# EAGLE design MxxxRow (EAGLE 6.6.0)

## Sheet 1 of 6
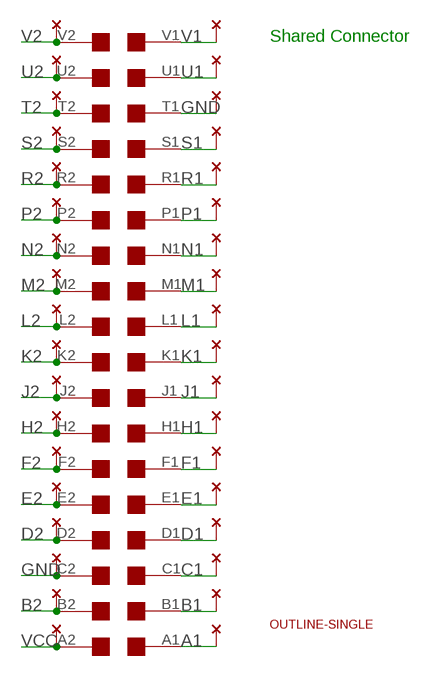
[diagram p0: schematic, sheet 1]

### Parts
U$1  EDGE-2CONNECTOR  [EDGE-CON2]
U$4  THRU-HOLE2A  [THRU-HOLEA]
U$5  OUTLINE-SINGLE  [SINGLE]

### Nets
A1: U$1.A1 U$4.A1 ; also sheet 2,3,4,5,6
B1: U$1.B1 U$4.B1 ; also sheet 2,3,4,5,6
B2: U$1.B2 U$4.B2
C1: U$1.C1 U$4.C1 ; also sheet 2,3,4,5,6
D1: U$1.D1 U$4.D1 ; also sheet 2,3,4,5,6
D2: U$1.D2 U$4.D2 ; also sheet 2,3,4,5,6
E1: U$1.E1 U$4.E1 ; also sheet 2,3,4,5
E2: U$1.E2 U$4.E2 ; also sheet 2,3,4,5,6
F1: U$1.F1 U$4.F1 ; also sheet 2,3,4,5,6
F2: U$1.F2 U$4.F2 ; also sheet 2,3,4,5,6
GND [Power]: U$1.C2 U$1.T1 U$4.C2 U$4.T1 ; also sheet 2,3,4,5,6
H1: U$1.H1 U$4.H1 ; also sheet 2,3,4,5,6
H2: U$1.H2 U$4.H2 ; also sheet 2,3,4,5,6
J1: U$1.J1 U$4.J1 ; also sheet 2,3,4,5,6
J2: U$1.J2 U$4.J2 ; also sheet 2,3,4,5,6
K1: U$1.K1 U$4.K1 ; also sheet 2,3,4,5,6
K2: U$1.K2 U$4.K2 ; also sheet 2,3,4,5,6
L1: U$1.L1 U$4.L1 ; also sheet 2,3,4,5
L2: U$1.L2 U$4.L2 ; also sheet 2,3,4,5,6
M1: U$1.M1 U$4.M1 ; also sheet 2,3,4,5,6
M2: U$1.M2 U$4.M2 ; also sheet 2,3,4,5,6
N1: U$1.N1 U$4.N1 ; also sheet 2,3,4,5,6
N2: U$1.N2 U$4.N2 ; also sheet 2,3,4,5,6
P1: U$1.P1 U$4.P1 ; also sheet 2,3,4,5,6
P2: U$1.P2 U$4.P2 ; also sheet 2,3,4,5,6
R1: U$1.R1 U$4.R1 ; also sheet 2,3,4,5,6
R2: U$1.R2 U$4.R2 ; also sheet 2,3,4,5,6
S1: U$1.S1 U$4.S1 ; also sheet 2,3,4,5
S2: U$1.S2 U$4.S2 ; also sheet 2,3,4,5,6
T2: U$1.T2 U$4.T2 ; also sheet 2,3,4,5,6
U1: U$1.U1 U$4.U1 ; also sheet 2,3,4
U2: U$1.U2 U$4.U2 ; also sheet 2,3,4,5,6
V1: U$1.V1 U$4.V1 ; also sheet 2,3,4
V2: U$1.V2 U$4.V2 ; also sheet 2,3,4,5,6
VCC [Power]: U$1.A2 U$4.A2 ; also sheet 2,3,4,5,6

### Notes on the sheet
- Shared Connector

## Sheet 2 of 6
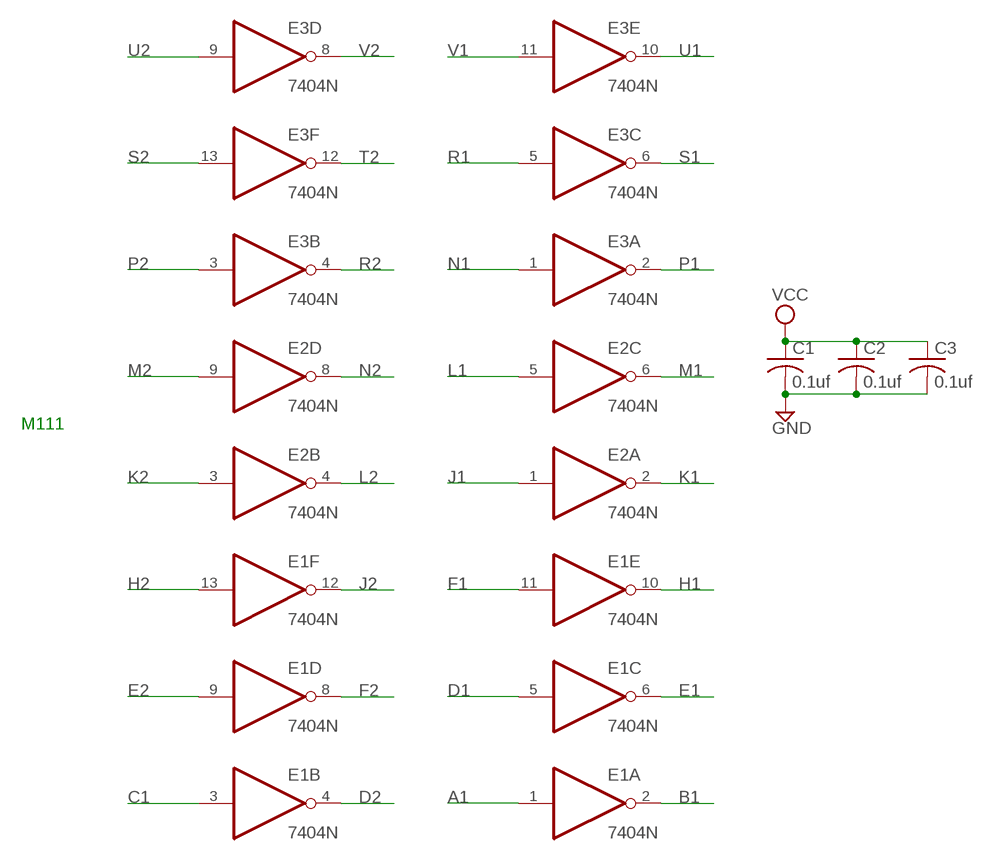
[diagram p1: schematic, sheet 2]

### Parts
C1  0.1uf  C-US050-025X075  [C050-025X075]
C2  0.1uf  C-US050-025X075  [C050-025X075]
C3  0.1uf  C-US050-025X075  [C050-025X075]
E1  7404N  [DIL14]
E2  7404N  [DIL14]
E3  7404N  [DIL14]

### Nets
A1: E1.1(A:I) ; also sheet 1,3,4,5,6
B1: E1.2(A:O) ; also sheet 1,3,4,5,6
C1: E1.3(B:I) ; also sheet 1,3,4,5,6
D1: E1.5(C:I) ; also sheet 1,3,4,5,6
D2: E1.4(B:O) ; also sheet 1,3,4,5,6
E1: E1.6(C:O) ; also sheet 1,3,4,5
E2: E1.9(D:I) ; also sheet 1,3,4,5,6
F1: E1.11(E:I) ; also sheet 1,3,4,5,6
F2: E1.8(D:O) ; also sheet 1,3,4,5,6
GND [Power]: C1.2 C2.2 C3.2 ; also sheet 1,3,4,5,6
H1: E1.10(E:O) ; also sheet 1,3,4,5,6
H2: E1.13(F:I) ; also sheet 1,3,4,5,6
J1: E2.1(A:I) ; also sheet 1,3,4,5,6
J2: E1.12(F:O) ; also sheet 1,3,4,5,6
K1: E2.2(A:O) ; also sheet 1,3,4,5,6
K2: E2.3(B:I) ; also sheet 1,3,4,5,6
L1: E2.5(C:I) ; also sheet 1,3,4,5
L2: E2.4(B:O) ; also sheet 1,3,4,5,6
M1: E2.6(C:O) ; also sheet 1,3,4,5,6
M2: E2.9(D:I) ; also sheet 1,3,4,5,6
N1: E3.1(A:I) ; also sheet 1,3,4,5,6
N2: E2.8(D:O) ; also sheet 1,3,4,5,6
P1: E3.2(A:O) ; also sheet 1,3,4,5,6
P2: E3.3(B:I) ; also sheet 1,3,4,5,6
R1: E3.5(C:I) ; also sheet 1,3,4,5,6
R2: E3.4(B:O) ; also sheet 1,3,4,5,6
S1: E3.6(C:O) ; also sheet 1,3,4,5
S2: E3.13(F:I) ; also sheet 1,3,4,5,6
T2: E3.12(F:O) ; also sheet 1,3,4,5,6
U1: E3.10(E:O) ; also sheet 1,3,4
U2: E3.9(D:I) ; also sheet 1,3,4,5,6
V1: E3.11(E:I) ; also sheet 1,3,4
V2: E3.8(D:O) ; also sheet 1,3,4,5,6
VCC [Power]: C1.1 C2.1 C3.1 ; also sheet 1,3,4,5,6
Unconnected: E2.10(E:O) E2.11(E:I) E2.12(F:O) E2.13(F:I)

### Notes on the sheet
- M111

## Sheet 3 of 6
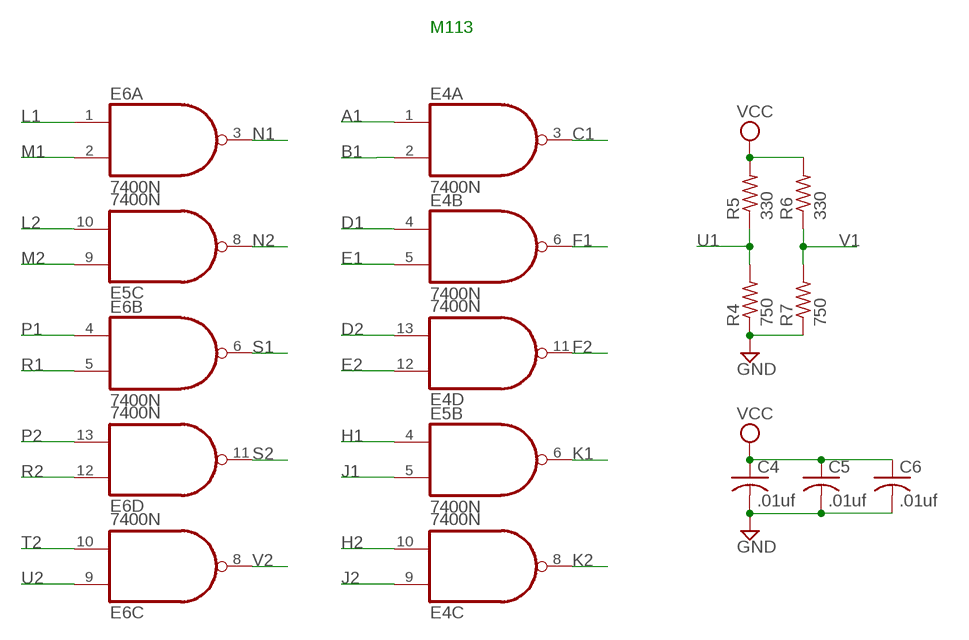
[diagram p2: schematic, sheet 3]

### Parts
C4  .01uf  C-US050-025X075  [C050-025X075]
C5  .01uf  C-US050-025X075  [C050-025X075]
C6  .01uf  C-US050-025X075  [C050-025X075]
E4  7400N  [DIL14]
E5  7400N  [DIL14]
E6  7400N  [DIL14]
R4  750  R-US_0207/10  [0207/10]
R5  330  R-US_0207/10  [0207/10]
R6  330  R-US_0207/10  [0207/10]
R7  750  R-US_0207/10  [0207/10]

### Nets
A1: E4.1(A:I0) ; also sheet 1,2,4,5,6
B1: E4.2(A:I1) ; also sheet 1,2,4,5,6
C1: E4.3(A:O) ; also sheet 1,2,4,5,6
D1: E4.4(B:I0) ; also sheet 1,2,4,5,6
D2: E4.13(D:I1) ; also sheet 1,2,4,5,6
E1: E4.5(B:I1) ; also sheet 1,2,4,5
E2: E4.12(D:I0) ; also sheet 1,2,4,5,6
F1: E4.6(B:O) ; also sheet 1,2,4,5,6
F2: E4.11(D:O) ; also sheet 1,2,4,5,6
GND [Power]: C4.2 C5.2 C6.2 R4.1 R7.1 ; also sheet 1,2,4,5,6
H1: E5.4(B:I0) ; also sheet 1,2,4,5,6
H2: E4.10(C:I1) ; also sheet 1,2,4,5,6
J1: E5.5(B:I1) ; also sheet 1,2,4,5,6
J2: E4.9(C:I0) ; also sheet 1,2,4,5,6
K1: E5.6(B:O) ; also sheet 1,2,4,5,6
K2: E4.8(C:O) ; also sheet 1,2,4,5,6
L1: E6.1(A:I0) ; also sheet 1,2,4,5
L2: E5.10(C:I1) ; also sheet 1,2,4,5,6
M1: E6.2(A:I1) ; also sheet 1,2,4,5,6
M2: E5.9(C:I0) ; also sheet 1,2,4,5,6
N1: E6.3(A:O) ; also sheet 1,2,4,5,6
N2: E5.8(C:O) ; also sheet 1,2,4,5,6
P1: E6.4(B:I0) ; also sheet 1,2,4,5,6
P2: E6.13(D:I1) ; also sheet 1,2,4,5,6
R1: E6.5(B:I1) ; also sheet 1,2,4,5,6
R2: E6.12(D:I0) ; also sheet 1,2,4,5,6
S1: E6.6(B:O) ; also sheet 1,2,4,5
S2: E6.11(D:O) ; also sheet 1,2,4,5,6
T2: E6.10(C:I1) ; also sheet 1,2,4,5,6
U1: R4.2 R5.1 ; also sheet 1,2,4
U2: E6.9(C:I0) ; also sheet 1,2,4,5,6
V1: R6.1 R7.2 ; also sheet 1,2,4
V2: E6.8(C:O) ; also sheet 1,2,4,5,6
VCC [Power]: C4.1 C5.1 C6.1 R5.2 R6.2 ; also sheet 1,2,4,5,6
Unconnected: E5.1(A:I0) E5.2(A:I1) E5.3(A:O) E5.11(D:O) E5.12(D:I0) E5.13(D:I1)

### Notes on the sheet
- M113

## Sheet 4 of 6
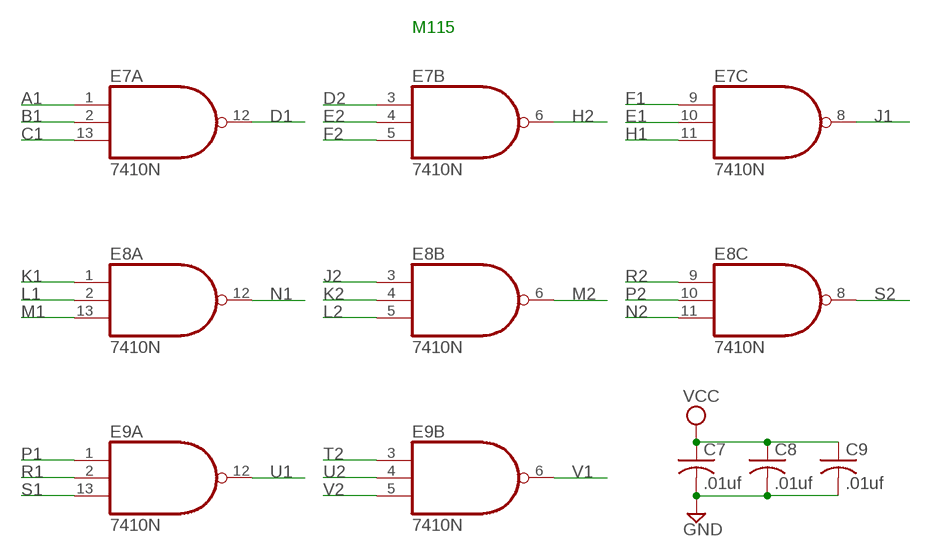
[diagram p3: schematic, sheet 4]

### Parts
C7  .01uf  C-US050-025X075  [C050-025X075]
C8  .01uf  C-US050-025X075  [C050-025X075]
C9  .01uf  C-US050-025X075  [C050-025X075]
E7  7410N  [DIL14]
E8  7410N  [DIL14]
E9  7410N  [DIL14]

### Nets
A1: E7.1(A:I0) ; also sheet 1,2,3,5,6
B1: E7.2(A:I1) ; also sheet 1,2,3,5,6
C1: E7.13(A:I2) ; also sheet 1,2,3,5,6
D1: E7.12(A:O) ; also sheet 1,2,3,5,6
D2: E7.3(B:I0) ; also sheet 1,2,3,5,6
E1: E7.10(C:I1) ; also sheet 1,2,3,5
E2: E7.4(B:I1) ; also sheet 1,2,3,5,6
F1: E7.9(C:I0) ; also sheet 1,2,3,5,6
F2: E7.5(B:I2) ; also sheet 1,2,3,5,6
GND [Power]: C7.2 C8.2 C9.2 ; also sheet 1,2,3,5,6
H1: E7.11(C:I2) ; also sheet 1,2,3,5,6
H2: E7.6(B:O) ; also sheet 1,2,3,5,6
J1: E7.8(C:O) ; also sheet 1,2,3,5,6
J2: E8.3(B:I0) ; also sheet 1,2,3,5,6
K1: E8.1(A:I0) ; also sheet 1,2,3,5,6
K2: E8.4(B:I1) ; also sheet 1,2,3,5,6
L1: E8.2(A:I1) ; also sheet 1,2,3,5
L2: E8.5(B:I2) ; also sheet 1,2,3,5,6
M1: E8.13(A:I2) ; also sheet 1,2,3,5,6
M2: E8.6(B:O) ; also sheet 1,2,3,5,6
N1: E8.12(A:O) ; also sheet 1,2,3,5,6
N2: E8.11(C:I2) ; also sheet 1,2,3,5,6
P1: E9.1(A:I0) ; also sheet 1,2,3,5,6
P2: E8.10(C:I1) ; also sheet 1,2,3,5,6
R1: E9.2(A:I1) ; also sheet 1,2,3,5,6
R2: E8.9(C:I0) ; also sheet 1,2,3,5,6
S1: E9.13(A:I2) ; also sheet 1,2,3,5
S2: E8.8(C:O) ; also sheet 1,2,3,5,6
T2: E9.3(B:I0) ; also sheet 1,2,3,5,6
U1: E9.12(A:O) ; also sheet 1,2,3
U2: E9.4(B:I1) ; also sheet 1,2,3,5,6
V1: E9.6(B:O) ; also sheet 1,2,3
V2: E9.5(B:I2) ; also sheet 1,2,3,5,6
VCC [Power]: C7.1 C8.1 C9.1 ; also sheet 1,2,3,5,6
Unconnected: E9.8(C:O) E9.9(C:I0) E9.10(C:I1) E9.11(C:I2)

### Notes on the sheet
- M115

## Sheet 5 of 6
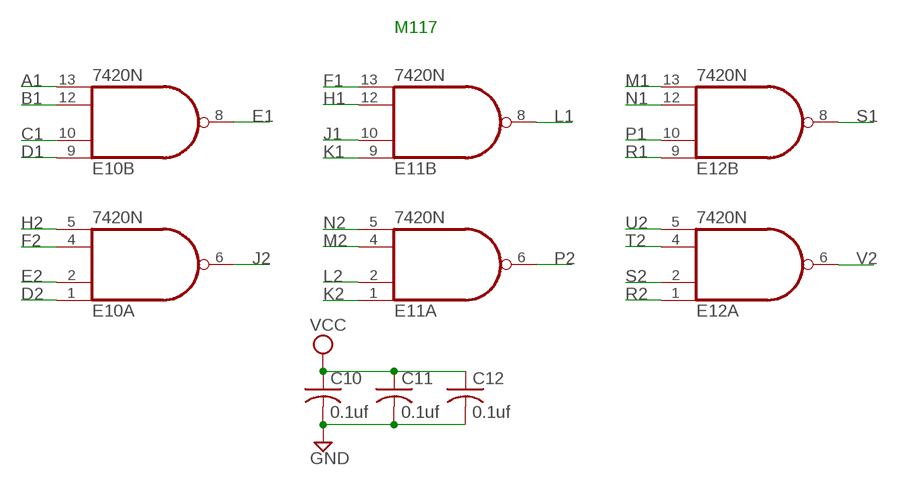
[diagram p4: schematic, sheet 5]

### Parts
C10  0.1uf  C-US050-025X075  [C050-025X075]
C11  0.1uf  C-US050-025X075  [C050-025X075]
C12  0.1uf  C-US050-025X075  [C050-025X075]
E10  7420N  74S20N  [DIL14]
E11  7420N  74S20N  [DIL14]
E12  7420N  74S20N  [DIL14]

### Nets
A1: E10.13(B:I3) ; also sheet 1,2,3,4,6
B1: E10.12(B:I2) ; also sheet 1,2,3,4,6
C1: E10.10(B:I1) ; also sheet 1,2,3,4,6
D1: E10.9(B:I0) ; also sheet 1,2,3,4,6
D2: E10.1(A:I0) ; also sheet 1,2,3,4,6
E1: E10.8(B:O) ; also sheet 1,2,3,4
E2: E10.2(A:I1) ; also sheet 1,2,3,4,6
F1: E11.13(B:I3) ; also sheet 1,2,3,4,6
F2: E10.4(A:I2) ; also sheet 1,2,3,4,6
GND [Power]: C10.2 C11.2 C12.2 ; also sheet 1,2,3,4,6
H1: E11.12(B:I2) ; also sheet 1,2,3,4,6
H2: E10.5(A:I3) ; also sheet 1,2,3,4,6
J1: E11.10(B:I1) ; also sheet 1,2,3,4,6
J2: E10.6(A:O) ; also sheet 1,2,3,4,6
K1: E11.9(B:I0) ; also sheet 1,2,3,4,6
K2: E11.1(A:I0) ; also sheet 1,2,3,4,6
L1: E11.8(B:O) ; also sheet 1,2,3,4
L2: E11.2(A:I1) ; also sheet 1,2,3,4,6
M1: E12.13(B:I3) ; also sheet 1,2,3,4,6
M2: E11.4(A:I2) ; also sheet 1,2,3,4,6
N1: E12.12(B:I2) ; also sheet 1,2,3,4,6
N2: E11.5(A:I3) ; also sheet 1,2,3,4,6
P1: E12.10(B:I1) ; also sheet 1,2,3,4,6
P2: E11.6(A:O) ; also sheet 1,2,3,4,6
R1: E12.9(B:I0) ; also sheet 1,2,3,4,6
R2: E12.1(A:I0) ; also sheet 1,2,3,4,6
S1: E12.8(B:O) ; also sheet 1,2,3,4
S2: E12.2(A:I1) ; also sheet 1,2,3,4,6
T2: E12.4(A:I2) ; also sheet 1,2,3,4,6
U2: E12.5(A:I3) ; also sheet 1,2,3,4,6
V2: E12.6(A:O) ; also sheet 1,2,3,4,6
VCC [Power]: C10.1 C11.1 C12.1 ; also sheet 1,2,3,4,6

### Notes on the sheet
- M117

## Sheet 6 of 6
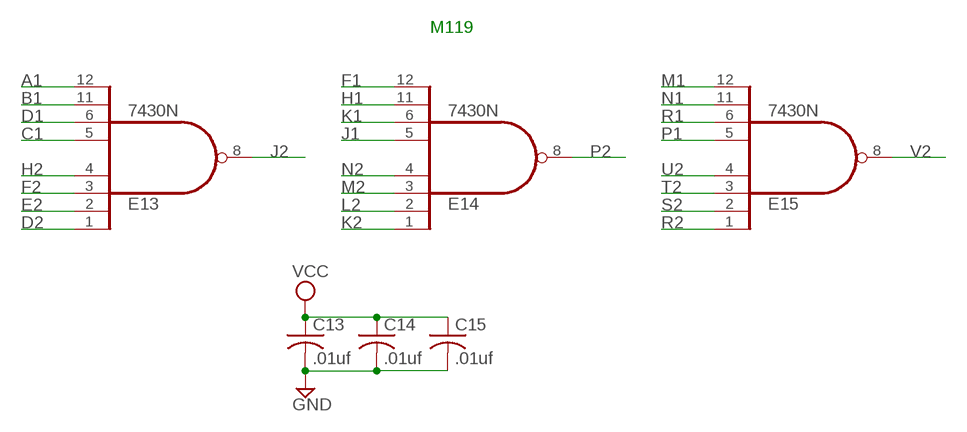
[diagram p5: schematic, sheet 6]

### Parts
C13  .01uf  C-US050-025X075  [C050-025X075]
C14  .01uf  C-US050-025X075  [C050-025X075]
C15  .01uf  C-US050-025X075  [C050-025X075]
E13  7430N  [DIL14]
E14  7430N  [DIL14]
E15  7430N  [DIL14]

### Nets
A1: E13.12(I7) ; also sheet 1,2,3,4,5
B1: E13.11(I6) ; also sheet 1,2,3,4,5
C1: E13.5(I4) ; also sheet 1,2,3,4,5
D1: E13.6(I5) ; also sheet 1,2,3,4,5
D2: E13.1(I0) ; also sheet 1,2,3,4,5
E2: E13.2(I1) ; also sheet 1,2,3,4,5
F1: E14.12(I7) ; also sheet 1,2,3,4,5
F2: E13.3(I2) ; also sheet 1,2,3,4,5
GND [Power]: C13.2 C14.2 C15.2 ; also sheet 1,2,3,4,5
H1: E14.11(I6) ; also sheet 1,2,3,4,5
H2: E13.4(I3) ; also sheet 1,2,3,4,5
J1: E14.5(I4) ; also sheet 1,2,3,4,5
J2: E13.8(O) ; also sheet 1,2,3,4,5
K1: E14.6(I5) ; also sheet 1,2,3,4,5
K2: E14.1(I0) ; also sheet 1,2,3,4,5
L2: E14.2(I1) ; also sheet 1,2,3,4,5
M1: E15.12(I7) ; also sheet 1,2,3,4,5
M2: E14.3(I2) ; also sheet 1,2,3,4,5
N1: E15.11(I6) ; also sheet 1,2,3,4,5
N2: E14.4(I3) ; also sheet 1,2,3,4,5
P1: E15.5(I4) ; also sheet 1,2,3,4,5
P2: E14.8(O) ; also sheet 1,2,3,4,5
R1: E15.6(I5) ; also sheet 1,2,3,4,5
R2: E15.1(I0) ; also sheet 1,2,3,4,5
S2: E15.2(I1) ; also sheet 1,2,3,4,5
T2: E15.3(I2) ; also sheet 1,2,3,4,5
U2: E15.4(I3) ; also sheet 1,2,3,4,5
V2: E15.8(O) ; also sheet 1,2,3,4,5
VCC [Power]: C13.1 C14.1 C15.1 ; also sheet 1,2,3,4,5

### Notes on the sheet
- M119

## Power pins joined to a net without a drawn wire
GND: E1.7(P:GND) E2.7(P:GND) E3.7(P:GND) E4.7(P:GND) E5.7(P:GND) E6.7(P:GND) E7.7(P:GND) E8.7(P:GND) E9.7(P:GND) E10.7(P:GND) E11.7(P:GND) E12.7(P:GND) E13.7(GND) E14.7(GND) E15.7(GND)
VCC: E1.14(P:VCC) E2.14(P:VCC) E3.14(P:VCC) E4.14(P:VCC) E5.14(P:VCC) E6.14(P:VCC) E7.14(P:VCC) E8.14(P:VCC) E9.14(P:VCC) E10.14(P:VCC) E11.14(P:VCC) E12.14(P:VCC) E13.14(VCC) E14.14(VCC) E15.14(VCC)

## Library data of the parts
C1-C15 = rcl:C-US: CAPACITOR, American symbol
E1-E3 = 74xx-us:74*04: Hex INVERTER
E4-E6 = 74xx-us:74*00: Quad 2-input NAND gate
E7-E9 = 74xx-us:74*10: Triple 3-input NAND gate
E10-E12 = 74xx-us:74*20: Dual 4-input NAND gate
E13-E15 = 74xx-us:74*30: 8-input NAND gate
R4-R7 = rcl:R-US_: RESISTOR, American symbol
U$1 = dec-con:EDGE-2: Double-Sided DEC edge connector.
U$4 = dec-con:THRU-HOLE2: Thru-Hole addition to double-sided edge connector.
U$5 = dec-con:OUTLINE-*: Board outlines for DEC boards.

## Net classes
1 Power: width 0.381 mm

## Board
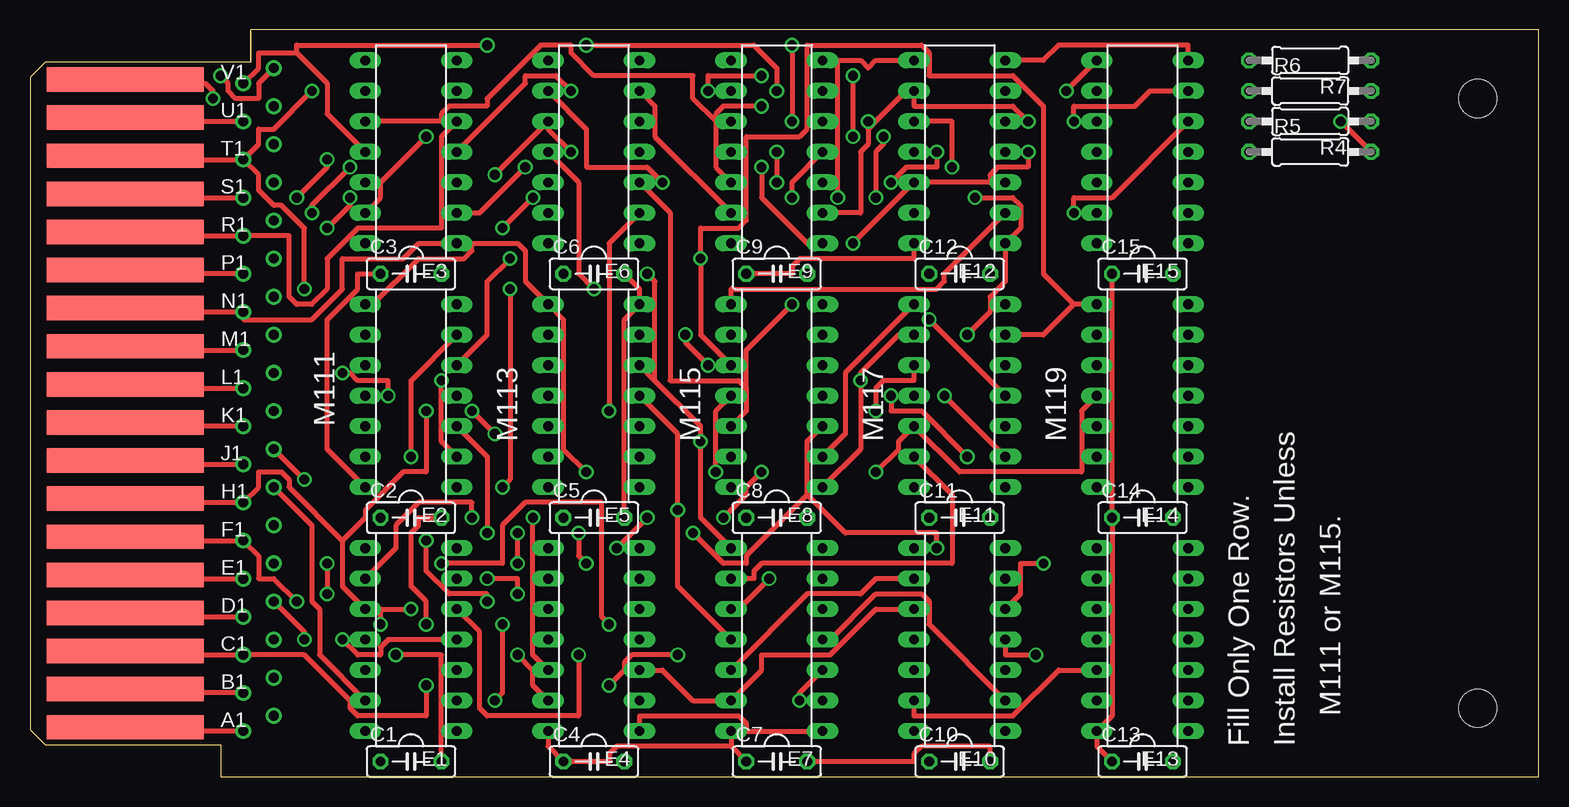
[diagram p6: board, top side]
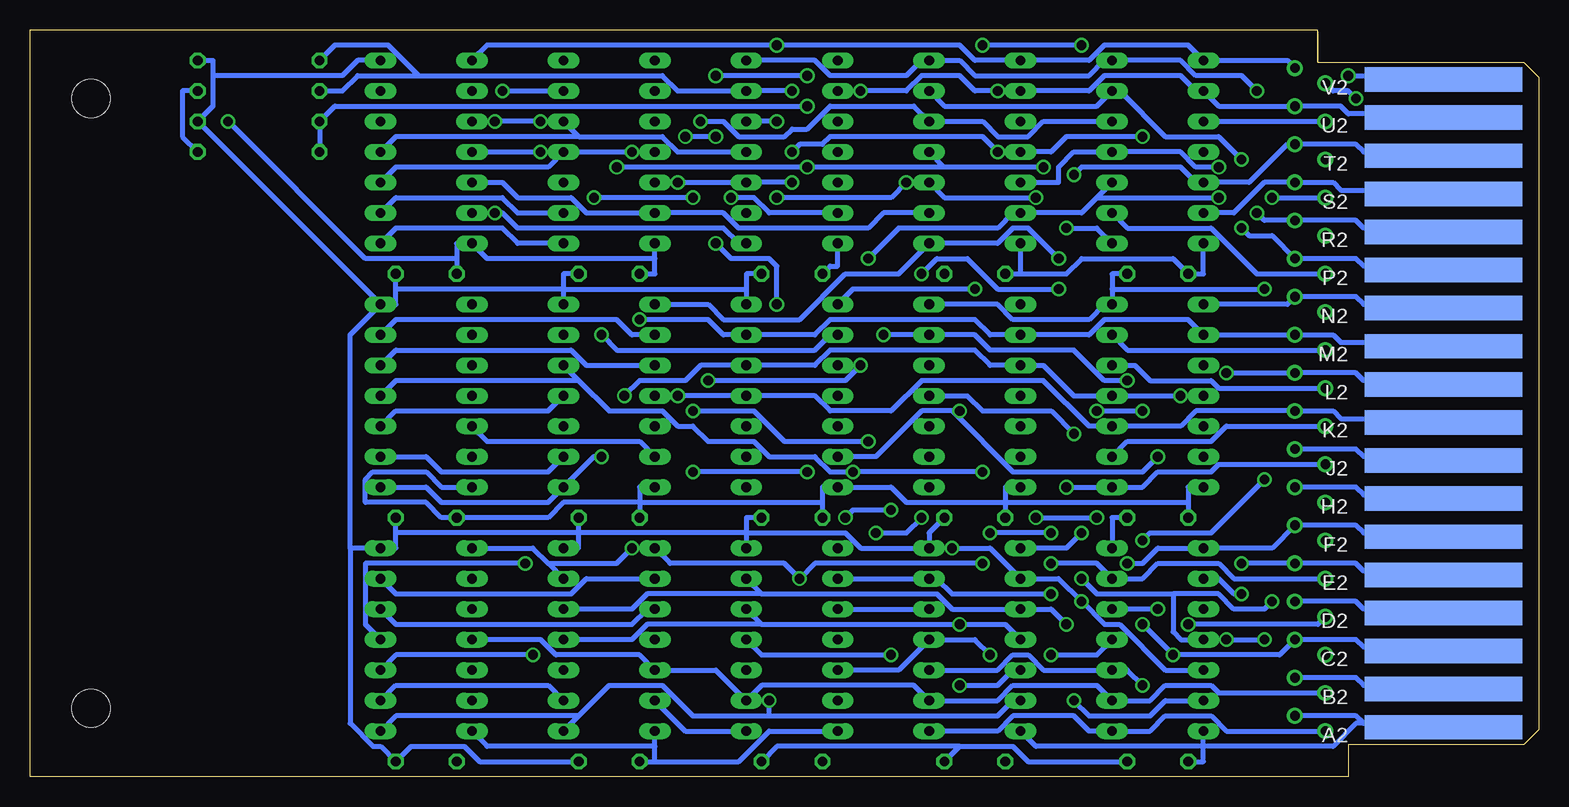
[diagram p7: board, bottom side, seen from below]

Size 125.73 x 62.23 mm. Coordinates in mm from the lower left corner, seen from the top.
Copper layers (1+16): Top 0.035mm / dielectric 1.5mm / Bottom 0.035mm
Design rules "16mils": minimum track width 16mil, minimum drill 32mil, track to track 15mil, track to pad 10mil, pad to pad 10mil, via to via 10mil, smd to smd 10mil, copper to edge 13mil, drill to drill 10mil, minimum pad ring 10mil, minimum via ring 8mil, stop-mask expansion 0mil, vias tented up to drill 0mil, thermal gap 10mil

### Footprints (pad centres in the part's own frame; a part is rotated, then mirrored left to right if it is on the bottom)
C050-025X075 = drill 0.813 octagon: 1 -2.54,0; 2 2.54,0
DIL14 = drill 0.813 long: 1 -7.62,-3.81; 2 -5.08,-3.81; 3 -2.54,-3.81; 4 0,-3.81; 5 2.54,-3.81; 6 5.08,-3.81; 7 7.62,-3.81; 8 7.62,3.81; 9 5.08,3.81; 10 2.54,3.81; 11 0,3.81; 12 -2.54,3.81; 13 -5.08,3.81; 14 -7.62,3.81
0207/10 = drill 0.813 octagon: 1 -5.08,0; 2 5.08,0
EDGE-CON2 = smd 13.106 x 2.032: A1 7.938,4.128; B1 7.938,7.303; C1 7.938,10.477; D1 7.938,13.652; E1 7.938,16.828; F1 7.938,20.003; H1 7.938,23.177; J1 7.938,26.352; K1 7.938,29.527; L1 7.938,32.703; M1 7.938,35.877; N1 7.938,39.053; P1 7.938,42.227; R1 7.938,45.403; S1 7.938,48.578; T1 7.938,51.752; U1 7.938,54.928; V1 7.938,58.102 | smd 13.106 x 2.032 bottom: A2 7.938,4.128; B2 7.938,7.303; C2 7.938,10.477; D2 7.938,13.652; E2 7.938,16.828; F2 7.938,20.003; H2 7.938,23.177; J2 7.938,26.352; K2 7.938,29.527; L2 7.938,32.703; M2 7.938,35.877; N2 7.938,39.053; P2 7.938,42.227; R2 7.938,45.403; S2 7.938,48.578; T2 7.938,51.752; U2 7.938,54.928; V2 7.938,58.102
THRU-HOLEA = drill 0.813 pad 1.27: A1 17.78,3.81; A2 20.32,5.08; B1 17.78,6.985; B2 20.32,8.255; C1 17.78,10.16; C2 20.32,11.43; D1 17.78,13.335; D2 20.32,14.605; E1 17.78,16.51; E2 20.32,17.78; F1 17.78,19.685; F2 20.32,20.955; H1 17.78,22.86; H2 20.32,24.13; J1 17.78,26.035; J2 20.32,27.305; K1 17.78,29.21; K2 20.32,30.48; L1 17.78,32.385; L2 20.32,33.655; M1 17.78,35.56; M2 20.32,36.83; N1 17.78,38.735; N2 20.32,40.005; P1 17.78,41.91; P2 20.32,43.18; R1 17.78,45.085; R2 20.32,46.355; S1 17.78,48.26; S2 20.32,49.53; T1 17.78,51.435; T2 20.32,52.705; U1 17.78,54.61; U2 20.32,55.88; V1 17.78,57.785; V2 20.32,59.055
SINGLE = hole 3.175: 120.65,56.515; 120.65,5.715

### Placement (x,y rotation side)
C1  31.75,1.27 0 top
C2  31.75,21.59 0 top
C3  31.75,41.91 0 top
C4  46.99,1.27 0 top
C5  46.99,21.59 0 top
C6  46.99,41.91 0 top
C7  62.23,1.27 0 top
C8  62.23,21.59 0 top
C9  62.23,41.91 0 top
C10  77.47,1.27 0 top
C11  77.47,21.59 0 top
C12  77.47,41.91 0 top
C13  92.71,1.27 0 top
C14  92.71,21.59 0 top
C15  92.71,41.91 0 top
E1  31.75,11.43 90 top
E2  31.75,31.75 90 top
E3  31.75,52.07 90 top
E4  46.99,11.43 90 top
E5  46.99,31.75 90 top
E6  46.99,52.07 90 top
E7  62.23,11.43 90 top
E8  62.23,31.75 90 top
E9  62.23,52.07 90 top
E10  77.47,11.43 90 top
E11  77.47,31.75 90 top
E12  77.47,52.07 90 top
E13  92.71,11.43 90 top
E14  92.71,31.75 90 top
E15  92.71,52.07 90 top
R4  106.68,54.61 180 top
R5  106.68,52.07 0 top
R6  106.68,57.15 0 top
R7  106.68,59.69 180 top
U$1  0,0 0 top
U$4  0,0 0 top
U$5  0,0 0 top

### Tracks (layer width: path | path; a pad name or v marks a point on that pad's centre or on a via)
A1
  Top 0.406: E13.12 85.73,8.89 81.92,5.08 73.66,5.08 E10.13 | E7.1 59.69,3.81 59.69,4.45 59.06,5.08 50.8,5.08 E4.1 | U$4.A1 8.26,3.81 U$1.A1
  Bottom 0.406: E7.1 71.12,3.81 E10.13 | U$4.A1 26.04,3.81 27.31,5.08 31.12,5.08 32.39,3.81 E1.1 37.47,3.81 38.74,5.08 43.82,5.08 45.09,3.81 E4.1
B1
  Top 0.406: U$4.B1 8.26,6.99 U$1.B1
  Bottom 0.406: E13.11 83.19,11.43 81.92,10.16 74.93,10.16 E10.12 68.58,8.89 E7.2 64.77,7.62 52.07,7.62 E4.2 45.09,6.35 43.82,7.62 36.83,7.62 E1.2 32.39,6.35 31.12,7.62 27.31,7.62 26.67,6.99 U$4.B1
B2
  Bottom 0.406: U$4.B2 15.24,8.26 14.61,7.62 8.26,7.62 U$1.B2
C1  (via drill 0.81)
  Top 0.406: U$1.C1 8.26,10.16 U$4.C1 22.86,10.16 26.67,6.35 26.67,5.71 27.31,5.08 33.02,5.08 v33.02,7.62 | E4.3 52.71,8.89 55.25,6.35 E7.13 60.96,8.89 60.96,10.16 66.68,10.16 70.49,13.97 E10.10
  Bottom 0.406: E10.10 74.3,13.97 75.57,12.7 95.25,12.7 E13.5 | E4.3 45.09,8.89 43.82,10.16 42.55,10.16 41.28,8.89 E1.3 34.29,8.89 v33.02,7.62
D1  (via drill 0.81)
  Top 0.406: U$4.D1 8.26,13.34 U$1.D1 | v31.75,13.97 29.21,13.97 v29.21,12.7 | E7.12 64.77,15.24 69.22,15.24 70.49,16.51 E10.9 | E1.5 37.47,12.06 37.47,5.71 38.1,5.08 45.72,5.08 v45.72,10.16
  Bottom 0.406: v31.75,13.97 E1.5 | v29.21,12.7 18.42,12.7 U$4.D1 | E7.12 53.34,8.89 E4.4 46.99,11.43 v45.72,10.16 | E10.9 79.38,16.51 80.65,15.24 95.25,15.24 E13.6
D2  (via drill 0.81)
  Top 0.406: E7.3 64.14,6.99 v64.14,6.35 | v40.64,10.16 41.91,8.89 41.91,7.62 E4.13 | U$4.D2 22.86,12.06 v22.86,11.43 | v26.04,11.43 27.31,10.16 29.21,10.16 29.21,10.79 29.85,11.43 E1.4
  Bottom 0.406: U$4.D2 15.24,14.61 14.61,13.97 8.26,13.97 U$1.D2 | E4.13 43.82,6.35 45.09,5.08 64.14,5.08 | 64.14,5.08 70.49,5.08 73.03,7.62 77.47,7.62 80.01,5.08 | E10.1 80.01,5.08 | 64.14,5.08 v64.14,6.35 | E13.1 95.25,5.08 80.01,5.08 | E1.4 36.83,10.16 v40.64,10.16 | v26.04,11.43 v22.86,11.43
E1  (via drill 0.81)
  Top 0.406: v61.6,16.51 59.06,13.97 E7.10 | U$4.E1 8.26,16.51 U$1.E1 | v46.36,17.78 45.72,18.41 v45.72,20.32 | v40.64,17.78 v40.64,20.32
  Bottom 0.406: E7.10 E4.5 | E10.8 72.39,17.78 62.87,17.78 v61.6,16.51 60.33,17.78 v46.36,17.78 | U$4.E1 25.4,16.51 26.67,17.78 31.75,17.78 33.02,16.51 E1.6 36.83,17.78 v40.64,17.78 | v40.64,20.32 v45.72,20.32
E2  (via drill 0.81)
  Top 0.406: v24.77,17.78 v24.77,15.24 | v48.26,7.62 49.53,8.89 49.53,9.53 50.17,10.16 v53.98,10.16 | E10.2 74.93,12.7 74.93,14.61 74.3,15.24 70.49,15.24 66.68,11.43 E7.4 | E1.9 30.48,19.05 30.48,20.95 32.39,22.86 36.83,22.86 v36.83,21.59 | v41.91,21.59 41.91,10.16 E4.12
  Bottom 0.406: U$1.E2 8.26,17.14 14.61,17.14 15.24,17.78 U$4.E2 v24.77,17.78 | E1.9 26.67,16.51 25.4,15.24 v24.77,15.24 | E10.2 82.55,7.62 95.25,7.62 E13.2 | E4.12 43.82,8.89 45.09,7.62 v48.26,7.62 | v53.98,10.16 64.77,10.16 E7.4 | v41.91,21.59 v36.83,21.59
F1  (via drill 0.81)
  Top 0.406: v22.23,14.61 20.32,16.51 19.05,16.51 19.05,18.41 U$4.F1 8.26,19.68 U$1.F1 | E7.9 60.33,16.51 60.33,17.14 60.96,17.78 76.84,17.78 76.84,23.5 E11.13 | v38.1,16.51 40.64,16.51 v40.64,15.24
  Bottom 0.406: E1.11 29.85,11.43 30.48,12.06 30.48,15.24 | 30.48,15.24 26.67,15.24 25.4,13.97 22.86,13.97 v22.23,14.61 | E7.9 E4.6 50.17,16.51 48.9,15.24 v40.64,15.24 | E11.13 74.93,27.94 87.63,27.94 E14.12 | 30.48,15.24 36.83,15.24 v38.1,16.51
F2  (via drill 0.81)
  Top 0.406: v83.82,10.16 81.28,10.16 E10.4 | v34.29,17.78 39.37,17.78 39.37,20.95 41.28,22.86 47.63,22.86 47.63,13.34 v48.26,12.7
  Bottom 0.406: U$1.F2 8.26,20.32 14.61,20.32 15.24,20.95 U$4.F2 22.23,19.05 E1.8 31.75,19.05 33.02,17.78 v34.29,17.78 | E4.11 44.45,12.7 v48.26,12.7 64.77,12.7 | E7.5 64.77,12.7 | E10.4 75.57,11.43 74.3,12.7 64.77,12.7 | E13.3 95.25,10.16 v83.82,10.16
GND  (via drill 0.81)
  Top 0.406: U$4.T1 8.26,51.44 U$1.T1 | v23.5,57.15 20.32,53.98 19.05,53.98 19.05,52.7 U$4.T1 | E12.7 84.46,59.69 85.73,60.96 96.52,60.96 E15.7 | C2.2 32.39,21.59 32.39,20.95 31.75,20.32 31.75,15.88 33.02,14.61 v33.02,12.7 | C6.2 50.8,40.64 E5.7 49.53,38.1 C5.2 | C7.2 73.66,1.27 73.66,1.91 74.3,2.54 80.01,2.54 C10.2 | v30.48,10.16 34.29,10.16 C1.2 | U$4.T1 19.05,50.16 19.05,48.9 20.32,47.62 20.96,47.62 22.86,45.72 v22.86,40.64
  Bottom 0.406: E9.7 60.33,59.69 59.06,58.42 52.71,58.42 51.44,59.69 E6.7 48.26,59.69 46.99,58.42 37.47,58.42 36.2,59.69 E3.7 29.85,59.69 28.58,58.42 24.77,58.42 v23.5,57.15 | 95.25,40.64 95.25,39.37 E14.7 | 95.25,40.64 C15.2 | 66.04,40.64 66.04,41.91 C9.2 | 66.04,40.64 E8.7 | 81.28,40.64 81.28,41.91 C12.2 | 81.28,40.64 E11.7 | 81.28,40.64 66.04,40.64 | 81.28,40.64 95.25,40.64 | 110.49,58.42 110.49,59.69 R7.1 | 110.49,58.42 110.49,55.88 R4.1 E14.7 | 110.49,58.42 99.7,58.42 98.43,59.69 E15.7 | E1.7 35.56,21.59 C2.2 | U$1.C2 8.26,10.79 14.61,10.79 15.24,11.43 U$4.C2 21.59,10.16 v30.48,10.16 v33.02,12.7 | C1.2 42.55,1.27 43.82,2.54 48.26,2.54 | C4.2 48.26,2.54 | C7.2 63.5,2.54 48.26,2.54 | 35.56,40.64 35.56,41.91 C3.2 | 35.56,40.64 E2.7 36.2,39.37 37.47,38.1 43.82,38.1 45.09,39.37 E5.7 | C10.2 88.27,1.27 89.54,2.54 93.98,2.54 C13.2 96.52,2.54 97.16,2.54 99.06,4.45 99.06,19.05 | 95.25,20.32 95.25,19.05 E13.7 99.06,19.05 | 95.25,20.32 C14.2 | 80.01,20.32 80.01,19.05 E10.7 | 80.01,20.32 C11.2 | C5.2 50.8,20.32 E4.7 56.52,19.05 57.79,20.32 66.04,20.32 | 66.04,20.32 66.04,21.59 C8.2 | 66.04,20.32 E7.7 | 66.04,20.32 80.01,20.32 | 80.01,20.32 95.25,20.32 | E14.7 99.06,36.83 99.06,19.05 | 35.56,40.64 v22.86,40.64
H1  (via drill 0.81)
  Top 0.406: U$1.H1 8.26,22.86 U$4.H1 19.05,24.13 19.05,25.4 20.96,25.4 21.59,24.77 21.59,24.13 26.04,19.68 | E1.10 26.04,15.88 26.04,19.68 | E14.11 87.63,30.48 87.63,25.4 77.47,25.4 E11.12 72.39,27.94 72.39,27.3 v70.49,25.4 | E5.4 53.98,28.57 v53.98,22.23 53.98,15.88 E7.11 | v60.96,25.4 59.69,24.13 59.69,23.5 v57.79,21.59 | 26.04,19.68 27.94,21.59 27.94,22.23 31.12,25.4 33.02,25.4 v33.02,30.48 | v38.74,28.57 v36.83,30.48
  Bottom 0.406: v60.96,25.4 v70.49,25.4 | v57.79,21.59 57.15,22.23 v53.98,22.23 | v36.83,30.48 v33.02,30.48 | v38.74,28.57 40.64,30.48 46.36,30.48 47.63,31.75 E5.4
H2  (via drill 0.81)
  Top 0.406: E1.13 24.13,10.16 24.13,13.97 23.5,14.61 23.5,20.95 U$4.H2 | v84.46,17.78 82.55,17.78 82.55,15.24 E10.5 | v38.74,6.35 39.37,6.99 v39.37,12.7
  Bottom 0.406: U$4.H2 15.24,24.13 14.61,23.5 8.26,23.5 U$1.H2 | 64.77,15.24 50.17,15.24 48.9,13.97 E4.10 40.64,13.97 v39.37,12.7 | E7.6 64.77,15.24 | E10.5 75.57,13.97 74.3,15.24 64.77,15.24 | E13.4 97.79,12.7 97.79,17.78 v84.46,17.78 | E1.13 31.12,6.35 32.39,5.08 37.47,5.08 v38.74,6.35
J1  (via drill 0.81)
  Top 0.406: U$4.J1 8.26,26.04 U$1.J1 | 52.07,33.02 55.88,29.21 v55.88,27.94 55.88,21.59 E7.8 | 52.07,33.02 E5.5 | v70.49,30.48 70.49,32.38 71.12,33.02 73.66,33.02 E11.10 | v39.37,24.13 40.01,24.77 v40.01,40.64 | v51.44,41.91 52.07,41.27 52.07,33.02
  Bottom 0.406: U$4.J1 26.67,26.04 27.31,25.4 31.75,25.4 33.02,24.13 E2.1 v39.37,24.13 | E11.10 79.38,34.29 80.65,35.56 95.25,35.56 E14.5 | v55.88,27.94 62.87,27.94 65.41,30.48 v70.49,30.48 | v40.01,40.64 45.09,40.64 47.63,43.18 50.17,43.18 v51.44,41.91
J2  (via drill 0.81)
  Top 0.406: E8.3 64.77,27.94 64.77,23.5 | 64.77,23.5 67.95,20.32 75.57,20.32 v75.57,19.05 | v51.44,21.59 v48.9,19.05 | v55.25,20.32 57.79,17.78 59.69,17.78 59.69,18.41 64.77,23.5 | v22.86,24.77 U$4.J2 | v33.02,19.68 33.02,17.14 34.93,15.24 38.1,15.24 v38.1,14.61
  Bottom 0.406: U$4.J2 15.24,27.3 14.61,26.67 8.26,26.67 U$1.J2 | E1.12 31.12,8.89 34.93,12.7 36.2,12.7 v38.1,14.61 40.01,16.51 E4.9 45.72,19.05 v48.9,19.05 | 82.55,17.78 83.82,19.05 E13.8 | 82.55,17.78 E10.6 | v75.57,19.05 76.84,17.78 82.55,17.78 | v51.44,21.59 52.71,20.32 v55.25,20.32 | v22.86,24.77 27.31,20.32 32.39,20.32 v33.02,19.68
K1  (via drill 0.81)
  Top 0.406: E8.1 69.22,27.3 v69.22,33.02 69.22,33.66 72.39,36.83 E11.9 | v34.29,33.02 34.29,27.94 E2.2 | U$4.K1 8.26,29.21 U$1.K1 | v56.52,34.29 54.61,36.2 v54.61,36.83
  Bottom 0.406: E14.6 95.25,38.1 76.84,38.1 75.57,36.83 E11.9 | U$4.K1 26.04,29.21 27.31,27.94 34.29,27.94 E2.2 | v34.29,33.02 36.2,33.02 38.74,35.56 45.72,35.56 46.99,36.83 E5.6 v54.61,36.83 | v69.22,33.02 57.79,33.02 v56.52,34.29
K2  (via drill 0.81)
  Top 0.406: v38.1,20.32 38.1,26.67 E2.3 | v78.11,26.67 74.3,30.48 71.76,30.48 v71.76,31.75
  Bottom 0.406: E14.1 92.71,24.13 91.44,22.86 82.55,22.86 E11.1 78.74,26.67 v78.11,26.67 | E4.8 39.37,19.05 v38.1,20.32 | v71.76,31.75 E8.4 60.33,31.75 59.06,30.48 53.98,30.48 51.44,33.02 41.28,33.02 37.47,29.21 E2.3 29.85,29.21 28.58,30.48 U$4.K2 17.15,30.48 16.51,29.84 8.26,29.84 U$1.K2
L1  (via drill 0.81)
  Top 0.406: E8.2 67.95,28.57 67.95,33.66 E11.8 | U$4.L1 8.26,32.38 U$1.L1 | v40.01,43.18 38.1,41.27 38.1,36.83 E2.5
  Bottom 0.406: E11.8 69.22,39.37 67.95,38.1 61.6,38.1 57.79,41.91 53.34,41.91 E6.1 45.09,44.45 43.82,45.72 42.55,45.72 v40.01,43.18 | U$4.L1 26.67,32.38 27.31,33.02 32.39,33.02 33.66,34.29 E2.5
L2  (via drill 0.81)
  Top 0.406: v76.2,31.75 E11.2 | v26.04,33.66 26.67,33.66 27.31,33.02 29.85,33.02 v29.85,31.75
  Bottom 0.406: U$1.L2 8.26,33.02 14.61,33.02 15.24,33.66 U$4.L2 v26.04,33.66 | E11.2 82.55,25.4 91.44,25.4 92.71,26.67 E14.2 | v76.2,31.75 74.93,33.02 71.12,33.02 69.85,34.29 E8.5 60.33,34.29 59.06,35.56 46.99,35.56 45.72,34.29 E5.10 41.28,34.29 38.74,31.75 E2.4 v29.85,31.75
M1  (via drill 0.81)
  Top 0.406: U$4.M1 8.26,35.56 U$1.M1 | v48.26,30.48 48.26,44.45 E6.2 | E2.6 31.75,33.02 v31.75,26.67
  Bottom 0.406: U$4.M1 34.29,35.56 E2.6 | E15.12 86.36,49.53 85.09,48.26 80.65,48.26 79.38,46.99 E12.13 67.95,46.99 66.68,45.72 55.88,45.72 54.61,46.99 E6.2 | E8.13 55.25,26.67 51.44,30.48 48.9,30.48 | v48.26,30.48 48.9,30.48 | v31.75,26.67 33.02,25.4 43.82,25.4 48.9,30.48
M2  (via drill 0.81)
  Top 0.406: v74.93,38.1 E11.4
  Bottom 0.406: E11.4 82.55,30.48 95.25,30.48 E14.3 | v74.93,38.1 69.22,38.1 67.95,36.83 E8.6 60.33,36.83 59.06,38.1 46.99,38.1 45.72,36.83 E5.9 37.47,36.83 36.2,38.1 29.21,38.1 E2.9 U$4.M2 17.15,36.83 16.51,36.2 8.26,36.2 U$1.M2
N1  (via drill 0.81)
  Top 0.406: U$1.N1 8.26,38.73 U$4.N1 17.78,38.1 23.5,38.1 26.04,40.64 26.04,43.18 31.12,43.18 32.39,44.45 E3.1 | v83.19,52.07 83.19,50.8 80.65,50.8 80.01,50.16 80.01,49.53 E12.12 v68.58,44.45 | E8.12 59.69,30.48 59.69,32.38 | 59.69,32.38 59.06,33.02 53.34,33.02 53.34,46.99 E6.3 | v63.5,39.37 59.69,35.56 59.69,32.38 | v41.91,48.26 v39.37,45.72
  Bottom 0.406: E15.11 v83.19,52.07 | v68.58,44.45 67.31,43.18 64.14,43.18 63.5,42.55 v63.5,39.37 | E3.1 36.83,45.72 v39.37,45.72 | v41.91,48.26 49.53,48.26 E6.3
N2  (via drill 0.81)
  Top 0.406: E8.11 57.15,30.48 v57.15,25.4 | E2.8 28.58,39.37 32.39,43.18 36.2,43.18 36.83,43.81 36.83,44.45 40.64,44.45 41.28,43.81 41.28,41.27 E5.8 44.45,38.1 44.45,27.3 v46.36,25.4
  Bottom 0.406: E11.5 80.01,33.02 | 80.01,33.02 77.47,30.48 73.03,30.48 71.76,29.21 70.49,29.21 69.22,27.94 65.41,27.94 64.14,26.67 60.33,26.67 59.06,25.4 v57.15,25.4 v46.36,25.4 | E14.4 95.25,33.02 80.01,33.02 | E2.8 20.96,39.37 U$4.N2 15.24,40.01 14.61,39.37 8.26,39.37 U$1.N2
P1  (via drill 0.81)
  Top 0.406: v41.28,50.8 37.47,46.99 E3.2 | E9.1 64.77,44.45 60.96,48.26 v60.96,50.8 | E12.10 76.84,54.61 v76.84,50.8 | E15.5 90.17,48.26 87,48.26 v87,46.99 | U$4.P1 8.26,41.91 U$1.P1
  Bottom 0.406: U$4.P1 23.5,41.91 27.31,45.72 34.29,45.72 E3.2 | 49.53,50.8 E6.4 | v41.28,50.8 49.53,50.8 | 49.53,50.8 v60.96,50.8 v76.84,50.8 | v87,46.99 86.36,46.99 85.09,45.72 67.95,45.72 66.68,44.45 E9.1
P2  (via drill 0.81)
  Top 0.406: E11.6 84.46,36.83 87,39.37 | E14.8 87,39.37 | E8.10 55.88,36.83 v55.88,43.18 55.88,45.72 59.06,45.72 59.69,46.35 59.69,53.34 64.14,53.34 64.77,53.98 64.77,60.96 74.3,60.96 74.93,60.33 74.93,58.42 81.92,58.42 84.46,55.88 84.46,41.91 87,39.37 | v24.77,45.72 26.67,47.62 v26.67,48.26
  Bottom 0.406: U$1.P2 8.26,42.55 14.61,42.55 15.24,43.18 U$4.P2 22.23,45.09 24.13,45.09 v24.77,45.72 | E3.3 36.83,48.26 | 36.83,48.26 38.1,46.99 E6.13 43.82,46.99 45.09,45.72 53.34,45.72 v55.88,43.18 | 36.83,48.26 v26.67,48.26
R1  (via drill 0.81)
  Top 0.406: U$1.R1 8.26,45.09 U$4.R1 21.59,45.09 21.59,40.01 22.23,39.37 23.5,39.37 24.77,40.64 24.77,43.18 27.31,45.72 34.29,45.72 34.29,53.34 E3.5 | E9.2 69.22,46.99 69.22,52.07 69.85,52.7 69.85,53.98 70.49,54.61 | 70.49,54.61 73.03,57.15 E12.9 73.66,55.88 81.92,55.88 v83.19,54.61 | E15.6 93.35,57.15 92.08,55.88 87,55.88 v87,54.61 | 70.49,54.61 v69.85,54.61
  Bottom 0.406: E3.5 41.28,54.61 42.55,53.34 45.09,53.34 46.36,54.61 E6.5 52.07,55.88 59.06,55.88 60.96,53.98 62.23,53.98 62.87,53.34 66.68,53.34 67.95,54.61 v69.85,54.61 | v83.19,54.61 v87,54.61
R2  (via drill 0.81)
  Top 0.406: v78.11,36.83 80.01,38.73 80.01,40.01 81.28,41.27 E12.1 82.55,45.72 82.55,47.62 81.92,48.26 v78.74,48.26 | v26.67,50.8 23.5,47.62 v23.5,46.99 | v70.49,48.26 70.49,52.07 71.12,52.7 v71.12,53.34 | v68.58,58.42 v68.58,53.34 | v60.96,58.42 56.52,58.42 v56.52,57.15 | v45.09,57.15 43.82,58.42 41.28,58.42 41.28,57.78 E3.4
  Bottom 0.406: E8.9 59.06,36.83 60.33,35.56 76.84,35.56 v78.11,36.83 | E15.1 95.25,45.72 86.36,45.72 85.09,44.45 E12.1 | E6.12 40.01,49.53 40.01,50.8 38.74,52.07 E3.4 29.85,52.07 28.58,50.8 v26.67,50.8 | U$1.R2 8.26,45.72 14.61,45.72 15.24,46.35 U$4.R2 22.86,46.35 v23.5,46.99 | v70.49,48.26 v78.74,48.26 | v68.58,53.34 v71.12,53.34 | v60.96,58.42 v68.58,58.42 | v56.52,57.15 52.71,57.15 51.44,58.42 48.26,58.42 46.99,57.15 v45.09,57.15
S1  (via drill 0.81)
  Top 0.406: U$4.S1 8.26,48.26 U$1.S1 | E9.13 52.07,53.34 52.07,55.88 E6.6 | E12.8 70.49,59.69 69.85,59.05 69.22,59.69 67.31,59.69 v67.31,48.26 | v22.23,48.26 24.77,50.8 v24.77,51.44
  Bottom 0.406: E6.6 49.53,55.88 36.83,55.88 E3.6 34.93,57.15 31.12,53.34 26.67,53.34 v24.77,51.44 | v67.31,48.26 65.41,48.26 64.14,46.99 E9.13 | v22.23,48.26 U$4.S1
S2  (via drill 0.81)
  Top 0.406: v33.02,53.34 29.21,49.53 29.21,48.26 E3.13 | v46.99,40.64 45.72,41.91 45.72,49.53 E6.11 | E12.2 76.2,41.91 76.2,41.27 75.57,40.64 58.42,40.64 E8.8
  Bottom 0.406: E12.2 85.09,46.99 86.36,48.26 95.25,48.26 E15.2 | E3.13 25.4,46.99 22.86,49.53 U$4.S2 17.15,49.53 16.51,48.9 8.26,48.9 U$1.S2 | E6.11 40.64,52.07 39.37,53.34 v33.02,53.34 | E8.8 57.15,40.64 v46.99,40.64
T2  (via drill 0.81)
  Top 0.406: v71.76,49.53 73.03,50.8 75.57,50.8 v75.57,52.07 | v38.74,50.16 E6.10 43.18,53.98 v45.09,52.07 | v62.23,52.07 v62.23,49.53
  Bottom 0.406: v71.76,49.53 E9.3 v62.23,49.53 | v75.57,52.07 E12.4 82.55,50.8 95.25,50.8 E15.3 | v38.74,50.16 38.1,50.8 29.85,50.8 28.58,49.53 E3.12 24.13,49.53 20.96,52.7 U$4.T2 15.24,52.7 14.61,52.07 8.26,52.07 U$1.T2 | v62.23,52.07 61.6,52.7 59.69,52.7 59.06,53.34 46.36,53.34 v45.09,52.07
U1  (via drill 0.81)
  Top 0.406: U$4.U1 8.26,54.61 U$1.U1 | E9.12 57.15,50.8 57.15,54.61 | 57.15,54.61 57.15,55.24 57.79,55.88 v60.96,55.88 | E3.10 34.29,54.61 34.29,55.24 34.93,55.88 38.1,55.88 38.1,56.52 42.55,60.96 45.09,60.96 45.09,60.33 46.99,58.42 55.25,58.42 55.25,56.52 57.15,54.61
  Bottom 0.406: E3.10 U$4.U1 | v60.96,55.88 100.33,55.88 R4.2 R5.1
U2  (via drill 0.81)
  Top 0.406: E9.4 63.5,49.53 v63.5,48.26 | v52.71,49.53 51.44,50.8 46.36,50.8 46.36,53.98 E6.9
  Bottom 0.406: E9.4 71.76,52.07 73.03,53.34 80.01,53.34 | E12.5 80.01,53.34 | E15.4 95.25,53.34 80.01,53.34 | E6.9 37.47,57.15 36.2,58.42 29.85,58.42 28.58,57.15 E3.9 26.67,55.88 U$4.U2 16.51,55.88 15.88,55.24 8.26,55.24 U$1.U2 | v63.5,48.26 53.98,48.26 v52.71,49.53
V1  (via drill 0.81)
  Top 0.406: E3.11 24.77,55.24 24.77,57.78 22.23,60.33 | 22.23,60.33 19.05,60.33 19.05,59.05 U$4.V1 | v15.24,56.52 15.24,57.15 14.61,57.78 8.26,57.78 U$1.V1 | v62.23,57.15 62.23,59.05 60.33,60.96 v46.36,60.96 | v38.1,60.96 22.23,60.96 22.23,60.33
  Bottom 0.406: 93.35,58.42 98.43,58.42 99.7,57.15 R6.1 | 93.35,58.42 73.03,58.42 71.76,57.15 E9.6 v62.23,57.15 | R7.2 100.33,60.96 95.89,60.96 93.35,58.42 | U$4.V1 17.15,57.15 15.88,57.15 v15.24,56.52 | v38.1,60.96 v46.36,60.96
V2  (via drill 0.81)
  Top 0.406: E15.8 v86.36,57.15 | v63.5,60.96 v63.5,54.61 | v15.88,58.42 16.51,57.78 16.51,57.15 17.15,56.52 19.05,56.52 19.05,57.78 U$4.V2
  Bottom 0.406: v86.36,57.15 E12.6 | U$4.V2 20.96,59.69 E3.8 29.21,60.96 36.2,60.96 37.47,59.69 E6.8 46.99,59.69 48.26,60.96 v63.5,60.96 87.63,60.96 E15.8 | v63.5,54.61 E9.5 | v15.88,58.42 8.26,58.42 U$1.V2
VCC  (via drill 0.81)
  Top 0.406: C9.1 63.5,41.91 63.5,42.55 64.14,43.18 73.66,43.18 E12.14 | v109.22,54.61 R5.2 | E4.14 43.18,2.54 C4.1 48.26,1.27 48.26,1.91 48.9,2.54 58.42,2.54 | 58.42,2.54 C7.1 | E7.14 58.42,2.54 | C13.1 88.9,2.54 E13.14 90.17,5.08 C14.1 C15.1 | C3.1 27.31,41.91 27.31,40.64 24.77,38.1 24.77,27.3 E2.14
  Bottom 0.406: R5.2 113.03,53.34 113.03,57.15 R6.2 | 90.17,43.18 90.17,44.45 E15.14 87.63,43.18 73.66,43.18 | 90.17,43.18 C15.1 | E9.14 58.42,42.55 59.06,42.55 C9.1 | 73.66,43.18 73.66,41.91 C12.1 | 73.66,43.18 E12.14 | v109.22,54.61 97.79,43.18 90.17,43.18 | 27.94,2.54 27.94,1.27 C1.1 | 27.94,2.54 E1.14 | E4.14 41.91,2.54 27.94,2.54 | U$4.A2 15.24,5.08 14.61,4.45 | 14.61,4.45 8.26,4.45 U$1.A2 | 27.94,2.54 17.15,2.54 15.24,4.45 14.61,4.45 | E7.14 64.14,3.81 66.68,1.27 73.66,1.27 | C10.1 73.66,1.27 | 73.66,1.27 73.66,2.54 | 73.66,2.54 E10.14 | E13.14 87.63,2.54 73.66,2.54 | E3.14 27.94,41.91 C3.1 30.48,43.18 38.1,43.18 39.37,41.91 43.18,41.91 | 43.18,41.91 E6.14 | C6.1 43.18,41.91 | 29.21,22.86 29.21,24.13 E2.14 | 29.21,22.86 C2.1 | 44.45,22.86 44.45,24.13 E5.14 | 44.45,22.86 C5.1 | 44.45,22.86 29.21,22.86 | 59.69,22.86 59.69,24.13 E8.14 53.98,24.13 52.71,22.86 44.45,22.86 | 59.69,22.86 C8.1 | 74.93,22.86 74.93,24.13 E11.14 | 74.93,22.86 C11.1 | 74.93,22.86 81.28,22.86 82.55,21.59 C14.1 91.44,21.59 92.71,22.86 97.79,22.86 97.79,24.77 97.16,25.4 92.71,25.4 91.44,24.13 E14.14 | 74.93,22.86 59.69,22.86

### Text on the board
tNames: M111 | M113 | M115 | M117 | M119 | M111 or M115. | Fill Only One Row. | Install Resistors Unless